# Altium schematic sheet DigitalSignal.SchDoc
size A2
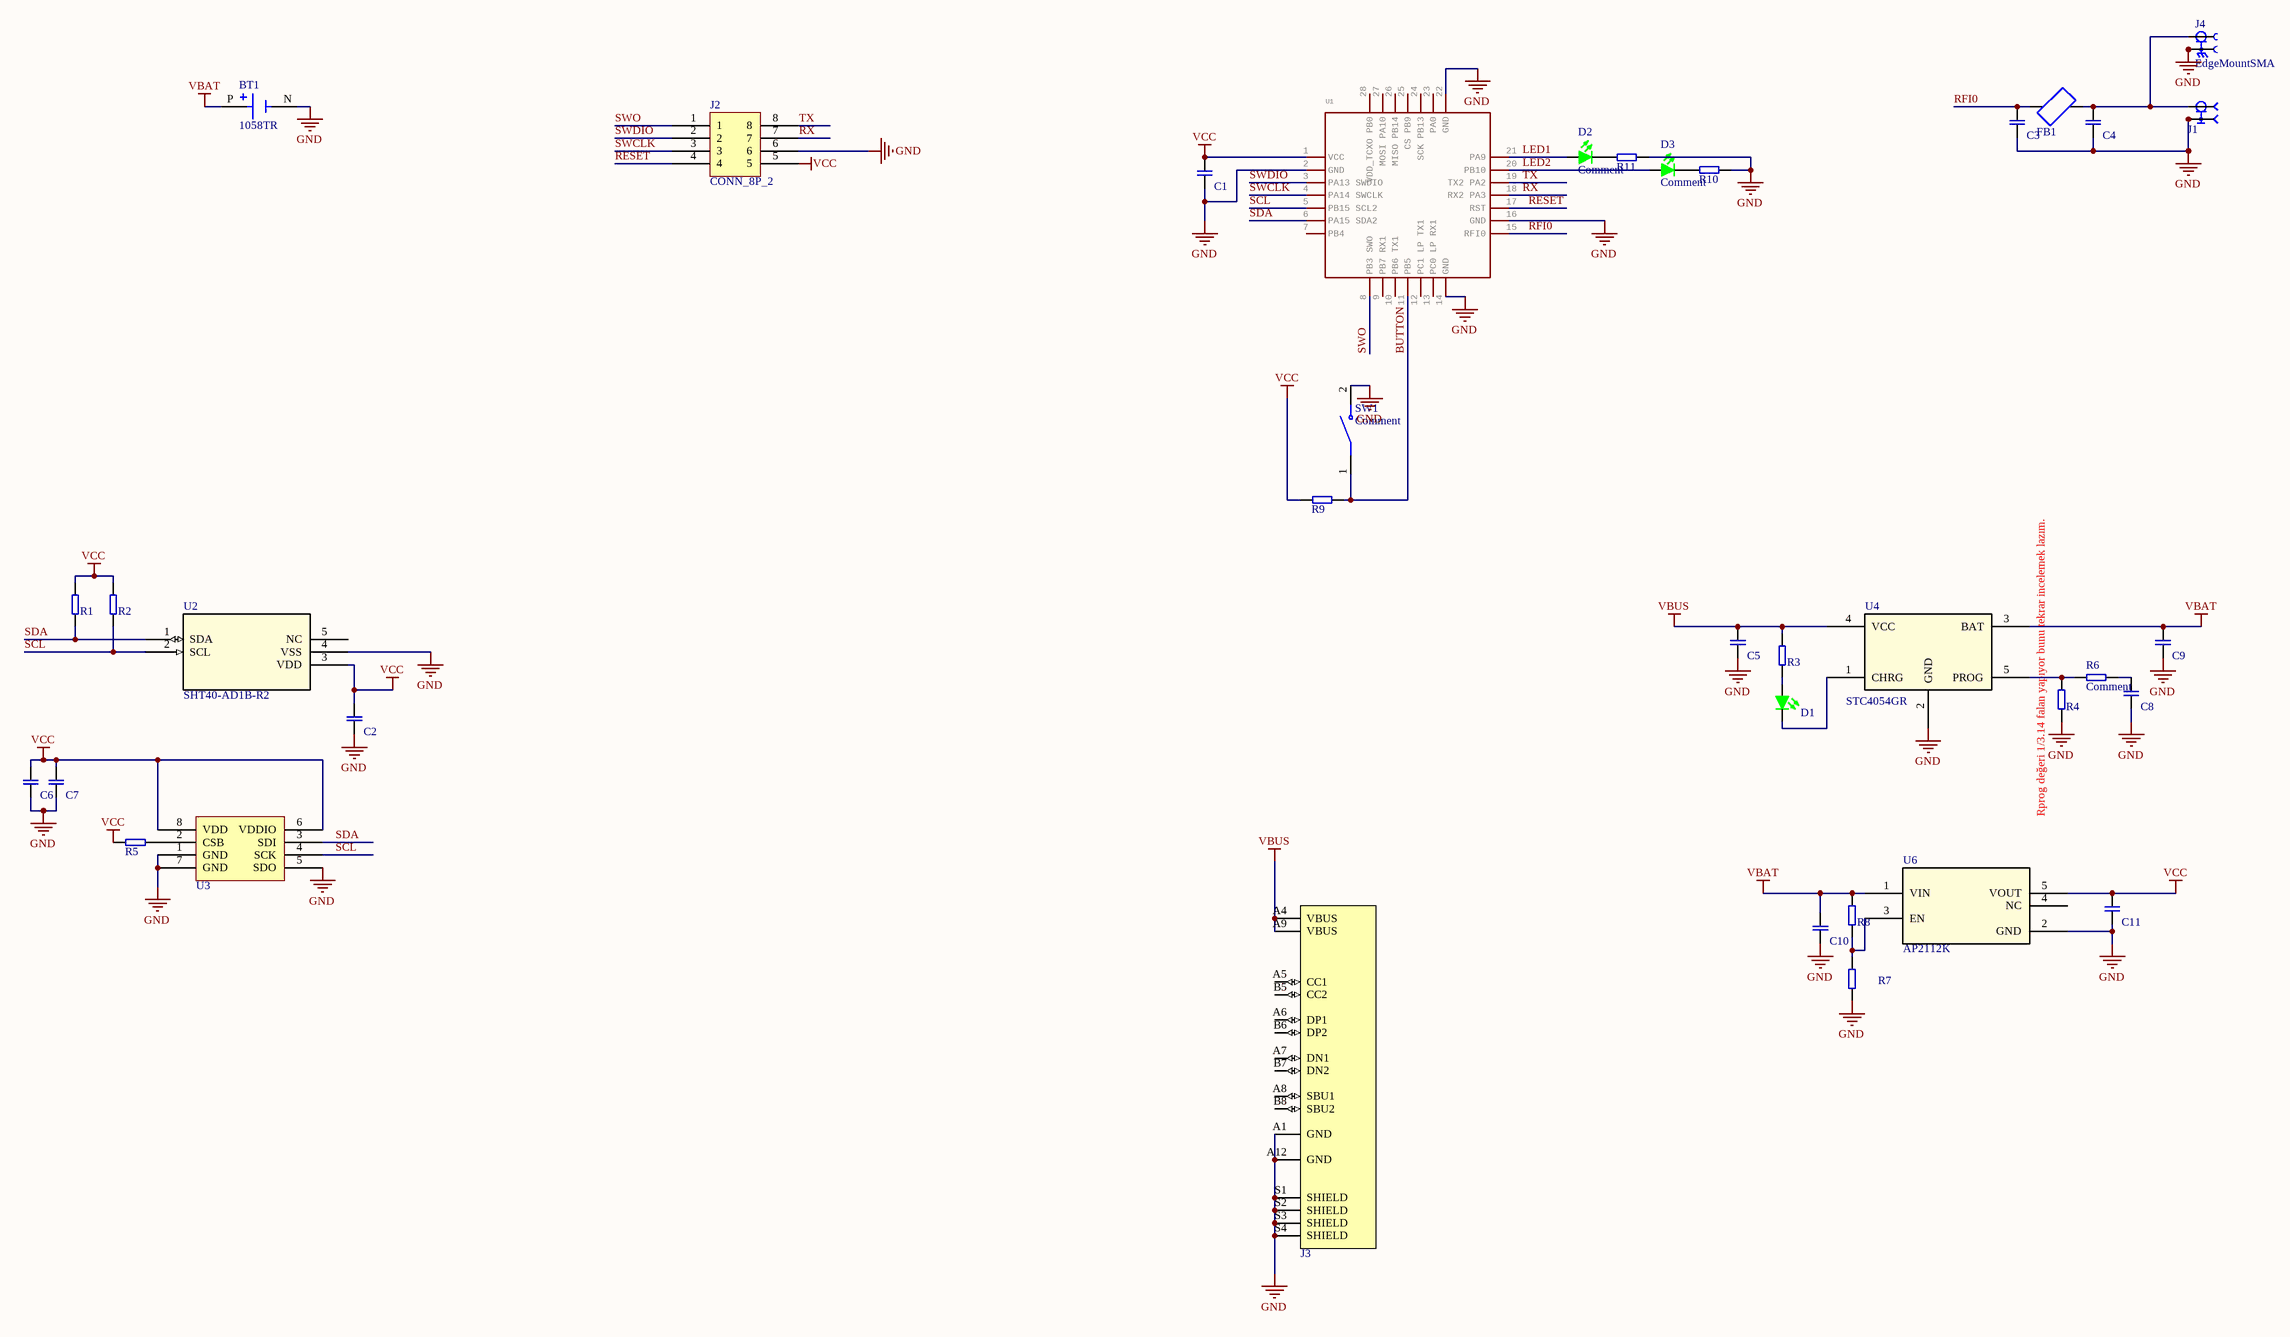
[diagram p0: DigitalSignal.SchDoc]

## Parts
BT1  1058TR  [BAT_1058TR]
C1  4.7nF  [C0402]  (value not drawn)
C2  100nF  [C0402]  (value not drawn)
C3  0.1uF  [C0402]  (value not drawn)
C4  0.1uF  [C0402]  (value not drawn)
C5  1uF  [C0603]  (value not drawn)
C6  1uF  [C0402]  (value not drawn)
C7  0.1uF  [C0402]  (value not drawn)
C8  100nF  [C0402]  (value not drawn)
C9  4.7uF  [C0603]  (value not drawn)
C10  1uF  [C0402]  (value not drawn)
C11  1uF  [C0402]  (value not drawn)
D1  SML-LX0603GW-TR  [L0603]  (value not drawn)
D2  Comment  [L0805 - GREEN]
D3  Comment  [L0805 - GREEN]
FB1  30Ohm  [FB0603]  (value not drawn)
J1  0734120114  [MOLEX_0734120114]  (value not drawn)
J2  CONN_8P_2  [CONN_8P_1.27MM]
J3  TYPE-C  [USB4105-GF-TYPEC]  (value not drawn)
J4  EdgeMountSMA  [EdgeMountSMA]
R1  1K  [R0402]  (value not drawn)
R2  1K  [R0402]  (value not drawn)
R3  1K  [R0402]  (value not drawn)
R4  330R  [R0603]  (value not drawn)
R5  1K  [R0402]  (value not drawn)
R6  Comment  [R0402]
R7  10K  [R0402]  (value not drawn)
R8  1K  [R0402]  (value not drawn)
R9  1K  [R0402]  (value not drawn)
R10  1K  [R0402]  (value not drawn)
R11  1K  [R0402]  (value not drawn)
SW1  Comment  [SW_B3U-3000P-B_OMR]
U1  Wio-E5  [Wio-E5]  (value not drawn)
U2  SHT40-AD1B-R2  [SHT4x_SEN-M]
U3  BMP280  [BOSCH_BMP280]  (value not drawn)
U4  STC4054GR  [SOP_TSOT23-5L_STM-L]
U6  AP2112K  [AP2112K]

## Nets
GND: BT1.N(NEG) C1.1 C2.1 C3.1 C4.1 C5.1 C6.1 C7.1 C8.1 C9.1 C10.1 C11.1 J1.2(GND) J1.3(GND) J1.4(GND) J2.6 J3.A1(GND) J3.A12(GND) J3.S1(SHIELD) J3.S2(SHIELD) J3.S3(SHIELD) J3.S4(SHIELD) J4.S1 J4.S2 J4.S3 J4.S4 R4.1 R7.1 R10.2 R11.2 SW1.2 U1.2(GND) U1.14(GND) U1.16(GND) U1.22(GND) U2.4(VSS) U3.1(GND) U3.5(SDO) U3.7(GND) U4.2(GND) U6.2(GND)
VBAT: BT1.P(POS) C9.2 C10.2 R8.2 U4.3(BAT) U6.1(VIN)
VBUS: C5.2 J3.A4(VBUS) J3.A9(VBUS) R3.2 U4.4(VCC)
VCC: C1.2 C2.2 C6.2 C7.2 C11.2 J2.5 R1.2 R2.2 R5.2 R9.1 U1.1(VCC) U2.3(VDD) U3.6(VDDIO) U3.8(VDD) U6.5(VOUT)
BUTTON: R9.2 SW1.1 U1.11(PB5)
LED1: D2.A U1.21(PA9)
LED2: D3.A U1.20(PB10)
RESET: J2.4 U1.17(RST)
RFI0: C3.2 FB1.1 U1.15(RFI0)
RX: J2.7 U1.18(RX2_PA3)
SCL: R2.1 U1.5(PB15_SCL2) U2.2(SCL) U3.4(SCK)
SDA: R1.1 U1.6(PA15_SDA2) U2.1(SDA) U3.3(SDI)
SWCLK: J2.3 U1.4(PA14_SWCLK)
SWDIO: J2.2 U1.3(PA13_SWDIO)
SWO: J2.1 U1.8(PB3_SWO)
TX: J2.8 U1.19(TX2_PA2)
NetC4_2: C4.2 FB1.2 J1.1(SIG) J4.1
NetC8_2: C8.2 R6.2
NetD1_A: D1.A R3.1
NetD1_C: D1.C U4.1(CHRG)
NetD2_C: D2.C R11.1
NetD3_C: D3.C R10.1
NetR4_2: R4.2 R6.1 U4.5(PROG)
NetR5_1: R5.1 U3.2(CSB)
NetR7_2: R7.2 R8.1 U6.3(EN)

Not connected (* = marked no-connect by the designer): J3 A5(CC1) A6(DP1) A7(DN1) A8(SBU1) B5(CC2) B6(DP2) B7(DN2) B8(SBU2); U1 7(PB4) 9(PB7_RX1) 10(PB6_TX1) 12(PC1_LP_TX1) 13(PC0_LP_RX1) 23(PA0) 24(SCK_PB13) 25(CS_PB9) 26(MISO_PB14) 27(MOSI_PA10) 28(VDD_TCXO_PB0); U2 5(NC); U6 4(NC)

## Notes on the sheet
- (near R4) Rprog değeri 1/3.14 falan yapıyor bunu tekrar incelemek lazım.

## Library data of the parts
BT1 = 20mm_BatteryHolder: Que: 136; Package: None; MP: 1058TR; Value: *; Price: None; Availability: Unavailable; Part Number: 20mm_BatteryHolder
C1 = 0402YC472KAT2A: CAP CER 4700PF 16V X7R 0402; Manufacturer: KYOCERA AVX; Que: 069; Tolerance: ±10%; Type: Ceramic; Name: Recep Aydin; Part Number: 0402YC472KAT2A; Voltage: 16V; Temperature Coefficient: X7R; Package: 0402(1005 Metric); Datasheet: https://datasheets.avx.com/X7RDielectric.pdf; Manufacturer Part Number: 0402YC472KAT2A
C2 C8 = CL05B104KB5NNNC: 402; Que: 129; Part Number: CL05B104KB5NNNC
C3 C4 C7 = 04023C104KAT2A: CAP CER 0.1UF 25V X7R 0402; Manufacturer: AVX Corporation; Que: 009; Tolerance: ±10%; Type: Ceramic; Name: Recep Aydin; Part Number: 04023C104KAT2A; Voltage: 25V; Temperature Coefficient: X7R; Package: 0402(1005 Metric); Datasheet: https://datasheets.avx.com/X7RDielectric.pdf; Manufacturer Part Number: 04023C104KAT2A
C5 = CGA3E1X7R1E105M080AC: CAP CER 1UF 25V X7R 0603; Manufacturer: TDK Corporation; Que: 017; Tolerance: ±20%; Type: Ceramic; Name: Recep Aydin; Part Number: CGA3E1X7R1E105M080AC; Voltage: 25V; Temperature Coefficient: X7R; Package: 0603(1608 Metric); Datasheet: https://product.tdk.com/en/system/files?file=dam/doc/product/capacitor/ceramic/mlcc/catalog/mlcc_automotive_general_en.pdf; Manufacturer Part Number: CGA3E1X7R1E105M080AC
C6 C10 C11 = CL05A105KO5NNNC: CAP CER 1UF 16V X5R 0402; Manufacturer: Samsung Electro-Mechanics; Que: 077; Tolerance: ±10%; Type: Ceramic; Name: Recep Aydin; Part Number: CL05A105KO5NNNC; Voltage: 16V; Temperature Coefficient: X5R; Package: 0402(1005 Metric); Datasheet: https://media.digikey.com/pdf/Data%20Sheets/Samsung%20PDFs/CL05A105KO5NNNC_Spec_5-2-19.pdf; Manufacturer Part Number: CL05A105KO5NNNC
C9 = C1608X5R1E475K080AC: CAP CER 4.7UF 25V X5R 0603; Manufacturer: TDK Corporation; Que: 081; Tolerance: ±10%; Type: Ceramic; Name: Recep Aydin; Part Number: C1608X5R1E475K080AC; Voltage: 25V; Temperature Coefficient: X5R; Package: 0603(1608 Metric); Datasheet: https://www.digikey.com/en/products/detail/tdk-corporation/C1608X5R1E475K080AC/3648581; Manufacturer Part Number: C1608X5R1E475K080AC
D1 = SML-LX0603GW-TR: LED GREEN DIFFUSED SMD; Manufacturer: Lumex Opto/Components Inc.; Que: 001; Forward Voltage: 2.2V; Current: 20mA; Name: Recep Aydin; Part Number: SML-LX0603GW-TR; LensTransparency: Diffused; Color: Green; Package: 0603(1608 Metric); Datasheet: https://www.lumex.com/datasheet/SML-LX0603GW-TR; Manufacturer Part Number: SML-LX0603GW-TR
D2 D3 = LTST-S220TBKT: LED SMD 0805 BLUE 28-180mcd 130° WATER CLEAR; Que: 010; Part Number: LTST-S220TBKT; Datasheet: https://cdn.ozdisan.com/ETicaret_Dosya/453892_2682026.PDF
FB1 = 742792609: FERRITE BEAD 30 OHM 0603 1LN; Manufacturer: Würth Elektronik; Que: 013; Filter Type: Power Line; Current: 3A; DC Resistance: 30 Ohms @ 100 MHz; Name: Recep Aydin; Part Number: 742792609; Package: 0603 (1608 Metric); Datasheet: https://www.we-online.com/katalog/datasheet/742792609.pdf; Manufacturer Part Number: 742792609
J1 = 0734120114: CONN UMC RCPT STR 50 OHM SMD; Manufacturer: Molex; Que: 021; Number of Position: 2; Connector Style: Receptacle, Male Pin; Name: Recep Aydin; Part Number: 0734120114; Mounting Type: Surface Mount Solder; Contact Finish: Gold; Datasheet: https://www.molex.com/pdm_docs/ps/PS-73598-021-001.pdf; Manufacturer Part Number: 0734120114
J2 = 8P_1.27mm: Que: 138; Part Number: 8P_1.27mm
J3 = USB4105-GF-TYPEC: MP: USB4125-GF-A_REVA2; Que: 111; Package: None; Availability: Unavailable; Value: *; Price: None; Part Number: USB4105-GF-TYPEC; Datasheet: https://gct.co/files/drawings/usb4105.pdf
J4 = EdgeMountSMA: MF: Linx Technologies; MP: CONSMA020.062-G; Que: 139; Price: None; Check_prices: https://www.snapeda.com/parts/CONSMA020.062-G/Linx/view-part/?ref=eda; Purchase-URL: https://pricing.snapeda.com/search/part/CONSMA020.062-G/?ref=eda; Value: *; Package: None; SnapEDA_Link: https://www.snapeda.com/parts/CONSMA020.062-G/Linx/view-part/?ref=snap; Availability: In Stock; Part Number: EdgeMountSMA
R1 R2 R5 R8 = RT0402BRE071KL: RES SMD 1K OHM 0.1% 1/16W 0402; Manufacturer: Yageo; Que: 015; Name: Recep Aydin; Part Number: RT0402BRE071KL; Tolerance: 0.1%; Resistor Type: Thick Film; Package: 0402; Datasheet: https://www.yageo.com/upload/media/product/productsearch/datasheet/rchip/PYu-RT_1-to-0.01_RoHS_L_12.pdf; Manufacturer Part Number: RT0402BRE071KL
R3 R9-R11 = RC0402JR-071KL: RES SMD 1K OHM 5% 1/16W 0402; Manufacturer: YAGEO; Que: 053; Name: Recep Aydin; Part Number: RC0402JR-071KL; Tolerance: 5%; Resistor Type: Thick Film; Package: 0402; Datasheet: https://www.yageo.com/upload/media/product/productsearch/datasheet/rchip/PYu-RC_Group_51_RoHS_L_11.pdf; Manufacturer Part Number: RC0402JR-071KL
R4 = RMCF0603FT330R: RES 330 OHM 1% 1/10W 0603; Manufacturer: Stackpole Electronics Inc; Que: 002; Tolerance: 0.1%; Name: Recep Aydin; Part Number: RMCF0603FT330R; Resistor Type: Thick Film; Package: 0603; Datasheet: https://www.seielect.com/catalog/sei-rmcf_rmcp.pdf; Manufacturer Part Number: RMCF0603FT330R
R6 = RC0100FR-0720KL: 20K/402; Que: 164; Part Number: RC0100FR-0720KL
R7 = RC1005F103CS: RES SMD 10K OHM 1% 1/16W 0402; Manufacturer: Samsung Electro-Mechanics; Que: 004; Tolerance: 0.1%; Name: Recep Aydin; Part Number: RC1005F103CS; Resistor Type: Thick Film; Package: 0402; Datasheet: https://media.digikey.com/pdf/Data%20Sheets/Samsung%20PDFs/RC_Series_ds.pdf; Manufacturer Part Number: RC1005F103CS
SW1 = SW_B3U-3000P-B_OMR: Manufacturer: Omron; Manufacturer Part Number: B3U-3000PM-B; Que: 012; Circuit: SPST; Part Number: SW_B3U-3000P-B_OMR; Datasheet: https://omronfs.omron.com/en_US/ecb/products/pdf/en-b3u.pdf; SPN: B3U-3000PM-B
U1 = Wio-E5: Seeed Lora Module; GateName_1: G$1; SymbolName_1: MOUDLE_LORA_E5; DeviceSetName: MODULE_LORA_E5; Que: 018; Core Processor: ARM® Cortex®-M4; LibraryName: LORA-E5_Eagle_Library; Package: MODULE28P-1.25-12X12X2.5MM; Part Number: Wio-E5; Datasheet: https://www.seeedstudio.com/LoRa-E5-Wireless-Module-p-4745.html?queryID=6caec7778acb48c076fea09690b6cc83&objectID=4745&indexName=bazaar_retailer_products; Manufacturer: Seeed; Manufacturer Part Number: Wio-E5
U2 = SHT40: Mfr_Name: Sensirion; Part Number: SHT40; Que: 007; Copyright: Copyright (C) 2023 Ultra Librarian. All rights reserved.; Manufacturer_Part_Number: SHT40-AD1B-R2; RefDes: RefDes; Type: DEV
U3 = BMP280: SENSOR PRESSURE ABS; Manufacturer: Bosch Sensortec; Que: 003; Voltage (C-E max): 1.71V ~ 3.6V; Name: Recep Aydin; Part Number: BMP280; Package: 8-SMD; Datasheet: https://www.bosch-sensortec.com/media/boschsensortec/downloads/datasheets/bst-bmp280-ds001.pdf; Manufacturer Part Number: BMP280
U4 = STC4054GR: Battery Charger IC; Mfr_Name: STMicroelectronics; Que: 011; RefDes: RefDes; Type: Type; Part Number: STC4054GR
U6 = AP2112K: LDO ADJ 3V3; Mfr_Name: Diodes Inc; Manufacturer: Diodes Incorporated; Manufacturer Part Number: AP2112K-3.3TRG1; Que: 036; VoltageIN: 6V; VoltageOUT: 3.3V; Name: AEG; RefDes: RefDes; Type: LDO; Part Number: AP2112K; Package: SOT25; Datasheet: https://www.diodes.com/assets/Datasheets/AP2112.pdf